# Altium schematic sheet ESP32 Coprocessor.SchDoc
size A; SheetNumber: 9; SheetTotal: 12
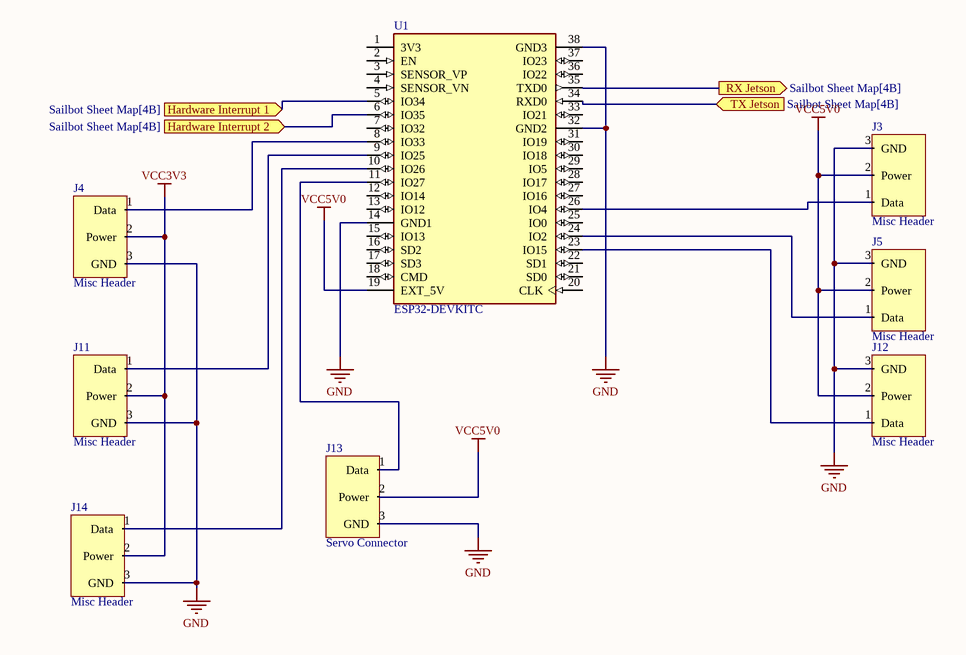
[diagram p0: ESP32 Coprocessor.SchDoc]

## Parts
J3  Misc Header  [3 Pin 0.1in Header]
J4  Misc Header  [3 Pin 0.1in Header]
J5  Misc Header  [3 Pin 0.1in Header]
J11  Misc Header  [3 Pin 0.1in Header]
J12  Misc Header  [3 Pin 0.1in Header]
J13  Servo Connector  [3 Pin 0.1in Header]
J14  Misc Header  [3 Pin 0.1in Header]
U1  ESP32-DEVKITC  [MODULE_ESP32-DEVKITC]

## Ports
Hardware Interrupt 1 (in, see Sailbot Sheet Map[4B]), Hardware Interrupt 2 (in, see Sailbot Sheet Map[4B]), RX Jetson (out, see Sailbot Sheet Map[4B]), TX Jetson (in, see Sailbot Sheet Map[4B])

## Nets
GND: J3.3(GND) J4.3(GND) J5.3(GND) J11.3(GND) J12.3(GND) J13.3(GND) J14.3(GND) U1.14(GND1) U1.32(GND2) U1.38(GND3)
VCC3V3: J4.2(Power) J11.2(Power) J14.2(Power)
VCC5V0: J3.2(Power) J5.2(Power) J12.2(Power) J13.2(Power) U1.19(EXT_5V)
Hardware Interrupt 1: U1.5(IO34) ; port Hardware Interrupt 1
Hardware Interrupt 2: U1.6(IO35) ; port Hardware Interrupt 2
RX Jetson: U1.35(TXD0) ; port RX Jetson
TX Jetson: U1.34(RXD0) ; port TX Jetson
NetJ3_1: J3.1(Data) U1.26(IO4)
NetJ4_1: J4.1(Data) U1.8(IO33)
NetJ5_1: J5.1(Data) U1.24(IO2)
NetJ11_1: J11.1(Data) U1.9(IO25)
NetJ12_1: J12.1(Data) U1.23(IO15)
NetJ13_1: J13.1(Data) U1.11(IO27)
NetJ14_1: J14.1(Data) U1.10(IO26)

Not connected (* = marked no-connect by the designer): U1 1(3V3) 2(EN) 3(SENSOR_VP) 4(SENSOR_VN) 7(IO32) 12(IO14) 13(IO12) 15(IO13) 16(SD2) 17(SD3) 18(CMD) 20(CLK) 21(SD0) 22(SD1) 25(IO0) 27(IO16) 28(IO17) 29(IO5) 30(IO18) 31(IO19) 33(IO21) 36(IO22) 37(IO23)

## Library data of the parts
J3-J5 J11 J12 J14 = Servo Connector
U1 = ESP32-DEVKITC: ESP32-WROOM-32UE series Transceiver; 802.11 b/g/n (Wi-Fi, WiFi, WLAN), Bluetooth Â® Smart Ready 4.x Dual Mode Evaluation Board; MF: Espressif Systems; Value: *; SnapEDA_Link: https://www.snapeda.com/parts/ESP32-DEVKITC/Espressif+Systems/view-part/?ref=snap; MP: ESP32-DEVKITC; Purchase-URL: https://pricing.snapeda.com/search/part/ESP32-DEVKITC/?ref=eda; Check_prices: https://www.snapeda.com/parts/ESP32-DEVKITC/Espressif+Systems/view-part/?ref=eda; Availability: In Stock; Price: None; Package: None